# EasyEDA Pro project ZeptoWatch.eprj, schematic Schematic5
Create Date: 2022-11-27; Page Name: P1; Project Name: ZeptoWatch; Schematic Name: Schematic5; Update Date: 2022-12-11; Company: 嘉立创EDA; Page Size: B; Version: V1.0
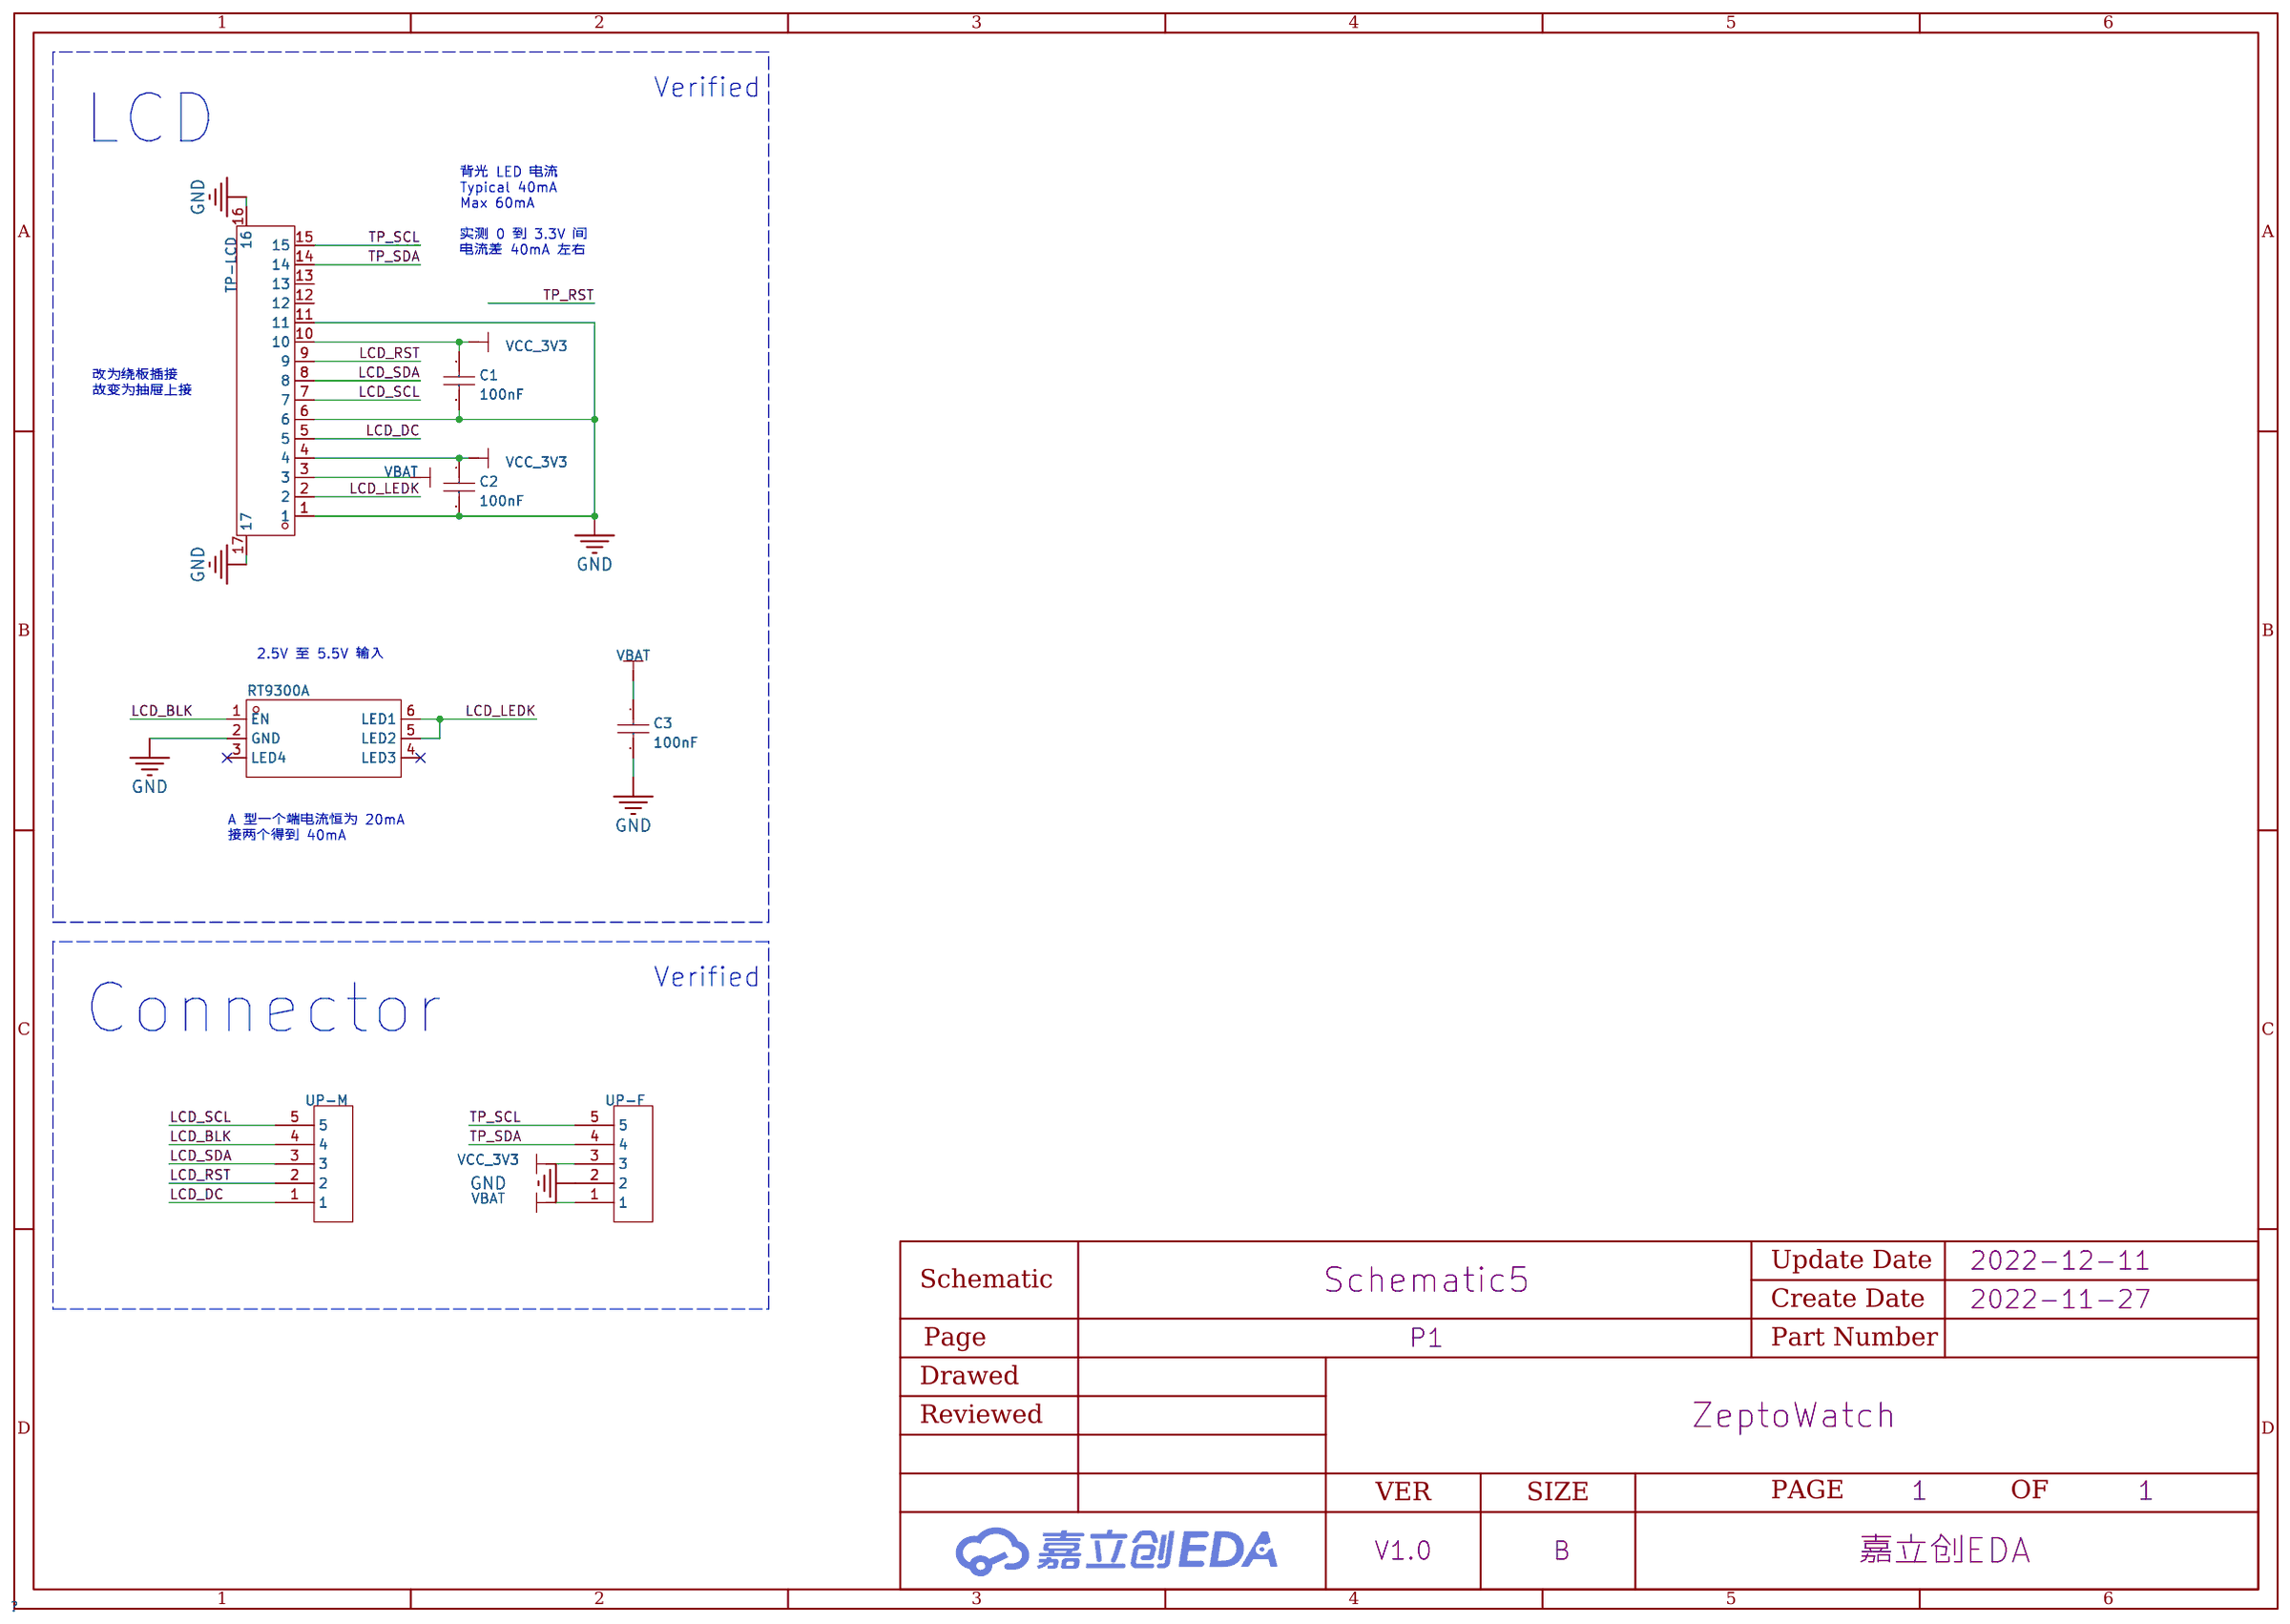
[diagram p4: schematic sheet]

## Parts
C1  100nF  [C0402]
C2  100nF  [C0402]
C3  100nF  [C0402]
RT9300A  -  [SOT-23-6_L2.9-W1.6-P0.95-LS2.8-BR]
TP-LCD  X05B20U15T  [FFC-SMD_15P-P0.50_X05B20U15T]
UP-F  -  [pogo-5pin-f]
UP-M  -  [pogo-5pin-m]

## Library data of the parts
C1-C3 = CC0402KRX7R9BB104: 容值:100nF;精度:±10%;额定电压:50V;材质(温度系数):X7R;; LCSC Part Name: 100nF ±10% 50V; Supplier Part: C131394; Manufacturer: YAGEO(国巨); Supplier Footprint: 0402; JLCPCB Part Class: 扩展库; Datasheet: https://atta.szlcsc.com/upload/public/pdf/source/20170925/C131394_1506321459057990237.pdf; Supplier: LCSC; Tolerance: ±10%; Voltage Rated: 50V; Temperature Coefficient: X7R
RT9300A = RT9300AGE: 类型:-;拓扑结构:-;内部开关:-;供电电压（最低）:-;供电电压（最高）:-;频率:-;; Supplier Part: C68151; Manufacturer: RICHTEK(台湾立锜); Supplier Footprint: SOT-23-6; JLCPCB Part Class: 扩展库; Datasheet: https://atta.szlcsc.com/upload/public/pdf/source/20180420/C68151_339603FDACFBF870F6D423A94B86B684.pdf; Supplier: LCSC
TP-LCD = X05B20U15T: 间距:0.5mm;触点数量:15;锁定特性:抽屉式;安装类型:卧贴;触点类型:上接;工作温度范围:-25~+85;焊接温度(最大值):260;; LCSC Part Name: 0.5mm P数:15 抽屉式 上接 镀锡; Supplier Part: C388701; Manufacturer: XKB Connectivity(中国星坤); Supplier Footprint: SMD,P=0.5mm; JLCPCB Part Class: 扩展库; Datasheet: https://atta.szlcsc.com/upload/public/pdf/source/20211011/8C194F98FD26D55C033D3194A9E7CFC8.pdf; Supplier: LCSC; Pitch: 0.5mm; Number of Contacts: 15; Locking Feature: 抽屉式; Mounting Type: 卧贴; Contact Type: 上接; Height Above Board: 2mm; FFC, FCB Thickness: 0.3mm; Contact Material: 磷青铜; Contact Plating: 锡; Operating Temperature Range: -25~+85; Welding Temperature (Max): 260
UP-F = pogo-5pin-f
UP-M = pogo-5pin-m

## Nets
GND: C1.2 C2.2 C3.2 RT9300A.2(GND) TP-LCD.1 TP-LCD.6 TP-LCD.11 TP-LCD.16 TP-LCD.17 UP-F.2
VBAT: C3.1 TP-LCD.3 UP-F.1
VCC_3V3: C1.1 C2.1 TP-LCD.4 TP-LCD.10 UP-F.3
LCD_BLK: RT9300A.1(EN) UP-M.4
LCD_DC: TP-LCD.5 UP-M.1
LCD_LEDK: RT9300A.5(LED2) RT9300A.6(LED1) TP-LCD.2
LCD_RST: TP-LCD.9 UP-M.2
LCD_SCL: TP-LCD.7 UP-M.5
LCD_SDA: TP-LCD.8 UP-M.3
TP_SCL: TP-LCD.15 UP-F.5
TP_SDA: TP-LCD.14 UP-F.4

Not connected (* = marked no-connect by the designer): RT9300A 3(LED4)* 4(LED3)*; TP-LCD 12 13

## Notes on the sheet
- Verified
- LCD
- 背光 LED 电流
  Typical 40mA
  Max 60mA
  实测 0 到 3.3V 间
  电流差 40mA 左右
- 改为绕板插接
  故变为抽屉上接
- 2.5V 至 5.5V 输入
- A 型一个端电流恒为 20mA
  接两个得到 40mA
- Verified
- Connector
